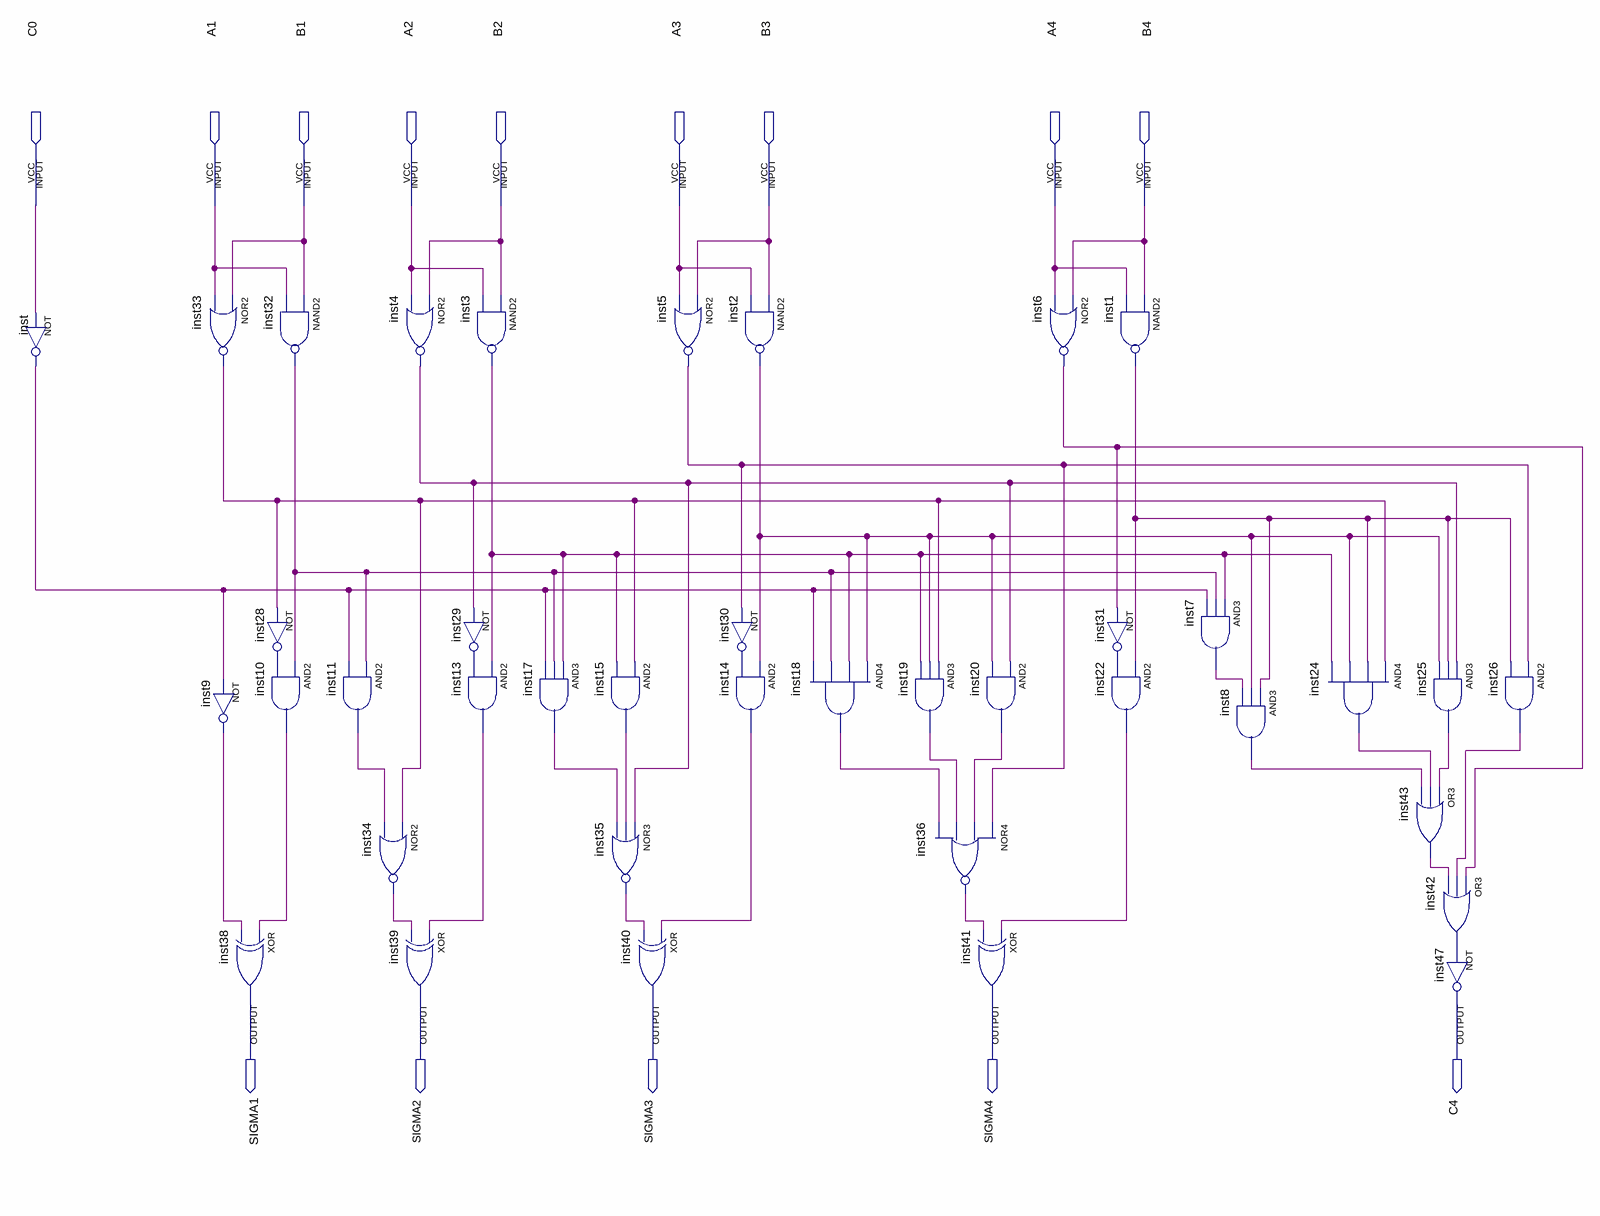
[diagram p0: schematic sheet]
// Quartus schematic DM74LS283.bdf as structural Verilog: 39 symbols, 14 pins
module DM74LS283 (
  input  C0,
  input  A1,
  input  B1,
  input  A2,
  input  B2,
  input  A3,
  input  B3,
  input  A4,
  input  B4,
  output SIGMA1,
  output SIGMA2,
  output SIGMA3,
  output SIGMA4,
  output C4
);

  wire inst1_out, inst2_out, inst3_out, inst4_out, inst5_out, inst6_out, inst7_out, inst8_out, inst9_out,
       inst10_out, inst11_out, inst13_out, inst14_out, inst15_out, inst17_out, inst18_out, inst19_out,
       inst20_out, inst22_out, inst24_out, inst25_out, inst26_out, inst28_out, inst29_out, inst30_out,
       inst31_out, inst32_out, inst33_out, inst34_out, inst35_out, inst36_out, inst42_out, inst43_out,
       inst_out;

  not inst (inst_out, C0);
  nor inst33 (inst33_out, B1, A1);
  not inst9 (inst9_out, inst_out);
  xor inst38 (SIGMA1, inst10_out, inst9_out);
  nand inst32 (inst32_out, B1, A1);
  not inst28 (inst28_out, inst33_out);
  and inst10 (inst10_out, inst32_out, inst28_out);
  and inst11 (inst11_out, inst32_out, inst_out);
  nor inst34 (inst34_out, inst33_out, inst11_out);
  nor inst4 (inst4_out, B2, A2);
  not inst29 (inst29_out, inst4_out);
  and inst13 (inst13_out, inst3_out, inst29_out);
  xor inst39 (SIGMA2, inst13_out, inst34_out);
  nand inst3 (inst3_out, B2, A2);
  and inst17 (inst17_out, inst3_out, inst32_out, inst_out);
  and inst15 (inst15_out, inst33_out, inst3_out);
  nor inst35 (inst35_out, inst4_out, inst15_out, inst17_out);
  nor inst5 (inst5_out, B3, A3);
  xor inst40 (SIGMA3, inst14_out, inst35_out);
  nand inst2 (inst2_out, B3, A3);
  not inst30 (inst30_out, inst5_out);
  and inst14 (inst14_out, inst2_out, inst30_out);
  and inst18 (inst18_out, inst2_out, inst3_out, inst32_out, inst_out);
  and inst19 (inst19_out, inst33_out, inst2_out, inst3_out);
  nor inst36 (inst36_out, inst5_out, inst20_out, inst19_out, inst18_out);
  and inst20 (inst20_out, inst4_out, inst2_out);
  xor inst41 (SIGMA4, inst22_out, inst36_out);
  nor inst6 (inst6_out, B4, A4);
  not inst31 (inst31_out, inst6_out);
  and inst22 (inst22_out, inst1_out, inst31_out);
  nand inst1 (inst1_out, B4, A4);
  and inst7 (inst7_out, inst3_out, inst32_out, inst_out);
  and inst8 (inst8_out, inst1_out, inst2_out, inst7_out);
  and inst24 (inst24_out, inst33_out, inst1_out, inst2_out, inst3_out);
  and inst25 (inst25_out, inst4_out, inst1_out, inst2_out);
  or inst43 (inst43_out, inst25_out, inst24_out, inst8_out);
  or inst42 (inst42_out, inst6_out, inst26_out, inst43_out);
  not inst47 (C4, inst42_out);
  and inst26 (inst26_out, inst5_out, inst1_out);
endmodule
